# Altium project OBC.PrjPcb
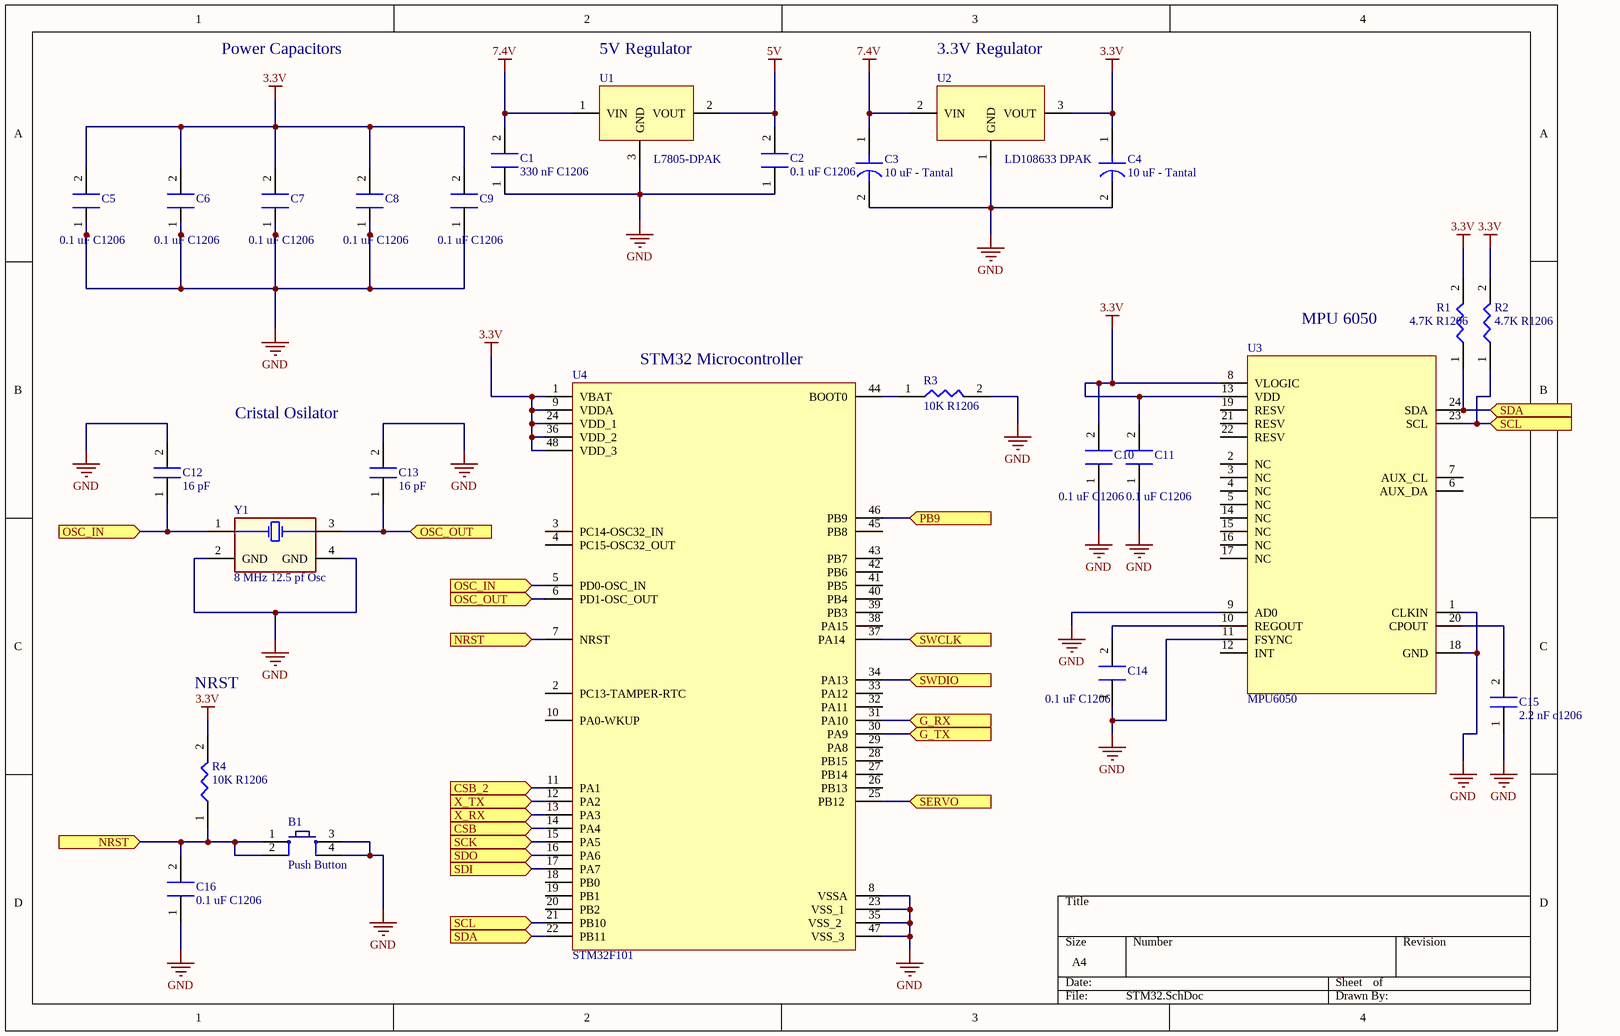
[diagram p0: STM32.SchDoc]
2 sheets, 38 parts. Net scope: flat (ports and power ports of the same name join across sheets).
Board file: STM32.PcbDoc
Sheets:
  STM32.SchDoc
  STM32-2.SchDoc

## Sheet STM32.SchDoc
size A4; SheetNumber: 1; SheetTotal: 2

### Parts
B1  Push Button  [PUSB BUTTON-SMD]
C1  330 nF C1206  [C1206]
C2  0.1 uF C1206  [C1206]
C3  10 uF - Tantal  [C1206- TANTAL]
C4  10 uF - Tantal  [C1206- TANTAL]
C5  0.1 uF C1206  [C1206]
C6  0.1 uF C1206  [C1206]
C7  0.1 uF C1206  [C1206]
C8  0.1 uF C1206  [C1206]
C9  0.1 uF C1206  [C1206]
C10  0.1 uF C1206  [C1206]
C11  0.1 uF C1206  [C1206]
C12  16 pF  [C1206]
C13  16 pF  [C1206]
C14  0.1 uF C1206  [C1206]
C15  2.2 nF c1206  [C1206]
C16  0.1 uF C1206  [C1206]
R1  4.7K R1206  [R1206 Resıstor]
R2  4.7K R1206  [R1206 Resıstor]
R3  10K R1206  [R1206 Resıstor]
R4  10K R1206  [R1206 Resıstor]
U1  L7805-DPAK  [DPAK228P972X230-3N]
U2  LD108633 DPAK  [DPAK228P972X230-3N]
U3  MPU6050  [QFN50P400X400X90_HS-25N]
U4  STM32F101  [LQFP48-STM]
Y1  8 MHz 12.5 pf Osc  [8 MHZ Osc.]

### Ports
CSB (in), CSB_2 (in), G_RX (in), G_TX (in), NRST (in), OSC_IN (in), OSC_OUT (in), PB9 (in), SCK (in), SCL (in), SDA (in), SDI (in), SDO (in), SERVO (in), SWCLK (in), SWDIO (in), X_RX (in), X_TX (in)

### Nets
3.3V: C4.1 C5.2 C6.2 C7.2 C8.2 C9.2 C10.2 C11.2 R1.2 R2.2 R4.2 U2.3(VOUT) U3.8(VLOGIC) U3.13(VDD) U4.1(VBAT) U4.9(VDDA) U4.24(VDD_1) U4.36(VDD_2) U4.48(VDD_3)
5V: C2.2 U1.2(VOUT)
7.4V: C1.2 C3.1 U1.1(VIN) U2.2(VIN)
GND: B1.3 B1.4 C1.1 C2.1 C3.2 C4.2 C5.1 C6.1 C7.1 C8.1 C9.1 C10.1 C11.1 C12.2 C13.2 C14.1 C15.1 C16.1 R3.2 U1.3(GND) U2.1(GND) U3.1(CLKIN) U3.9(AD0) U3.11(FSYNC) U3.18(GND) U4.8(VSSA) U4.23(VSS_1) U4.35(VSS_2) U4.47(VSS_3) Y1.2(GND) Y1.4(GND)
NetB1_1: B1.1 B1.2 C16.2 R4.1 U4.7(NRST) ; port NRST
NetB2_1: U4.46(PB9) ; port PB9
NetC12_1: C12.1 U4.5(PD0-OSC_IN) Y1.1 ; port OSC_IN
NetC13_1: C13.1 U4.6(PD1-OSC_OUT) Y1.3 ; port OSC_OUT
NetC14_2: C14.2 U3.10(REGOUT)
NetC15_2: C15.2 U3.20(CPOUT)
NetJ1_2: U4.11(PA1) ; port CSB_2
NetJ1_3: U4.17(PA7) ; port SDI
NetJ1_5: U4.15(PA5) ; port SCK
NetJ1_7: U4.16(PA6) ; port SDO
NetJ2_2: U4.37(PA14) ; port SWCLK
NetJ2_4: U4.34(PA13) ; port SWDIO
NetJ3_3: U4.30(PA9) ; port G_TX
NetJ3_4: U4.31(PA10) ; port G_RX
NetJ4_3: U4.12(PA2) ; port X_TX
NetJ4_4: U4.13(PA3) ; port X_RX
NetJ7_1: U4.25(PB12) ; port SERVO
NetR1_1: R1.1 U3.24(SDA) U4.22(PB11) ; port SDA
NetR2_1: R2.1 U3.23(SCL) U4.21(PB10) ; port SCL
NetR3_1: R3.1 U4.44(BOOT0)
NetU4_14: U4.14(PA4) ; port CSB

Not connected (* = marked no-connect by the designer): U3 2(NC) 3(NC) 4(NC) 5(NC) 6(AUX_DA) 7(AUX_CL) 12(INT) 14(NC) 15(NC) 16(NC) 17(NC) 19(RESV) 21(RESV) 22(RESV); U4 2(PC13-TAMPER-RTC) 3(PC14-OSC32_IN) 4(PC15-OSC32_OUT) 10(PA0-WKUP) 18(PB0) 19(PB1) 20(PB2) 26(PB13) 27(PB14) 28(PB15) 29(PA8) 32(PA11) 33(PA12) 38(PA15) 39(PB3) 40(PB4) 41(PB5) 42(PB6) 43(PB7) 45(PB8)

### Notes on the sheet
- Power Capacitors
- 5V Regulator
- 3.3V Regulator
- (near U4) STM32 Microcontroller
- MPU 6050
- (near C13) Cristal Osilator
- NRST

### Library data of the parts
B1 = Push Button: Smd Push Button; Satın Alma Linki: https://urun.n11.com/diger/mini-pushbutton-switch-smd-P227461537?gclid=Cj0KCQjwkoDmBRCcARIsAG3xzl8Y_-jeD7HocNM6lvuZ_rVp83568XPGtNzlPwXWLph8oCRqo0yh87UaApZYEALw_wcB&gclsrc=aw.ds
U1 = L7805-DPAK: L7805 5V REGULATOR. SMD PAKET
U2 = LD108633 DPAK: LD1086 3.3V REGULATOR
U3 = MPU6050: MPU6050 GYRO
U4 = STM32F101: STM32F101 48 PİNLİ MİKROİŞLEMCİ

## Sheet STM32-2.SchDoc
size A4; SheetNumber: 2; SheetTotal: 2
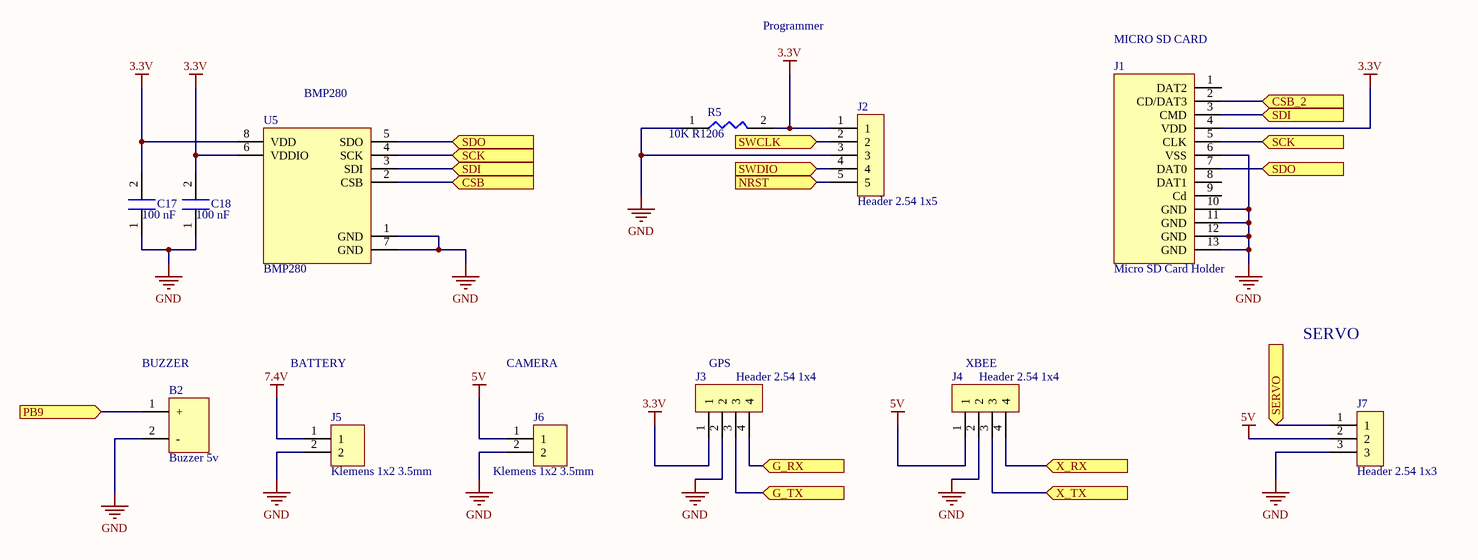
[diagram p1: STM32-2.SchDoc]

### Parts
B2  Buzzer 5v  [Buzzer 5v]
C17  100 nF  [C1206]
C18  100 nF  [C1206]
J1  Micro SD Card Holder  [Micro SD Card Holder]
J2  Header 2.54 1x5  [Header 2.54 1x5]
J3  Header 2.54 1x4  [Header 2.54 1x4]
J4  Header 2.54 1x4  [Header 2.54 1x4]
J5  Klemens 1x2 3.5mm  [Klemens 1x2 - 3.5mm]
J6  Klemens 1x2 3.5mm  [Klemens 1x2 - 3.5mm]
J7  Header 2.54 1x3  [Header 2.54 1x3]
R5  10K R1206  [R1206 Resıstor]
U5  BMP280  [BMP280]

### Ports
CSB (in), CSB_2 (in), G_RX (in), G_TX (in), NRST (in), PB9 (in), SCK (in), SDI (in), SDO (in), SERVO (in), SWCLK (in), SWDIO (in), X_RX (in), X_TX (in)

### Nets
3.3V: C17.2 C18.2 J1.4(VDD) J2.1 J3.1 R5.2 U5.6(VDDIO) U5.8(VDD)
5V: J4.1 J6.1 J7.2
7.4V: J5.1
GND: B2.2(-) C17.1 C18.1 J1.6(VSS) J1.10(GND) J1.11(GND) J1.12(GND) J1.13(GND) J2.3 J3.2 J4.2 J5.2 J6.2 J7.3 R5.1 U5.1(GND) U5.7(GND)
NetB1_1: J2.5 ; port NRST
NetB2_1: B2.1(+) ; port PB9
NetJ1_2: J1.2(CD/DAT3) ; port CSB_2
NetJ1_3: J1.3(CMD) U5.3(SDI) ; port SDI
NetJ1_5: J1.5(CLK) U5.4(SCK) ; port SCK
NetJ1_7: J1.7(DAT0) U5.5(SDO) ; port SDO
NetJ2_2: J2.2 ; port SWCLK
NetJ2_4: J2.4 ; port SWDIO
NetJ3_3: J3.3 ; port G_TX
NetJ3_4: J3.4 ; port G_RX
NetJ4_3: J4.3 ; port X_TX
NetJ4_4: J4.4 ; port X_RX
NetJ7_1: J7.1 ; port SERVO
NetU4_14: U5.2(CSB) ; port CSB

Not connected (* = marked no-connect by the designer): J1 1(DAT2) 8(DAT1) 9(Cd)

### Notes on the sheet
- Programmer
- (near J1) MICRO SD CARD
- (near U5) BMP280
- (near B2) BUZZER
- BATTERY
- CAMERA
- (near J3) GPS
- (near J4) XBEE
- SERVO

### Library data of the parts
U5 = BMP280: BMP280 SENSOR

## Nets that join several sheets
3.3V: STM32 (19 pins), STM32-2 (8 pins)
5V: STM32 (C2.2 U1.2), STM32-2 (J4.1 J6.1 J7.2)
7.4V: STM32 (C1.2 C3.1 U1.1 U2.2), STM32-2 (J5.1)
GND: STM32 (31 pins), STM32-2 (17 pins)
NetB1_1: STM32 (5 pins), STM32-2 (J2.5)
NetB2_1: STM32 (U4.46), STM32-2 (B2.1)
NetJ1_2: STM32 (U4.11), STM32-2 (J1.2)
NetJ1_3: STM32 (U4.17), STM32-2 (J1.3 U5.3)
NetJ1_5: STM32 (U4.15), STM32-2 (J1.5 U5.4)
NetJ1_7: STM32 (U4.16), STM32-2 (J1.7 U5.5)
NetJ2_2: STM32 (U4.37), STM32-2 (J2.2)
NetJ2_4: STM32 (U4.34), STM32-2 (J2.4)
NetJ3_3: STM32 (U4.30), STM32-2 (J3.3)
NetJ3_4: STM32 (U4.31), STM32-2 (J3.4)
NetJ4_3: STM32 (U4.12), STM32-2 (J4.3)
NetJ4_4: STM32 (U4.13), STM32-2 (J4.4)
NetJ7_1: STM32 (U4.25), STM32-2 (J7.1)
NetU4_14: STM32 (U4.14), STM32-2 (U5.2)